# Altium schematic sheet Buffers.SchDoc
size C; SheetNumber: 4; SheetTotal: 4
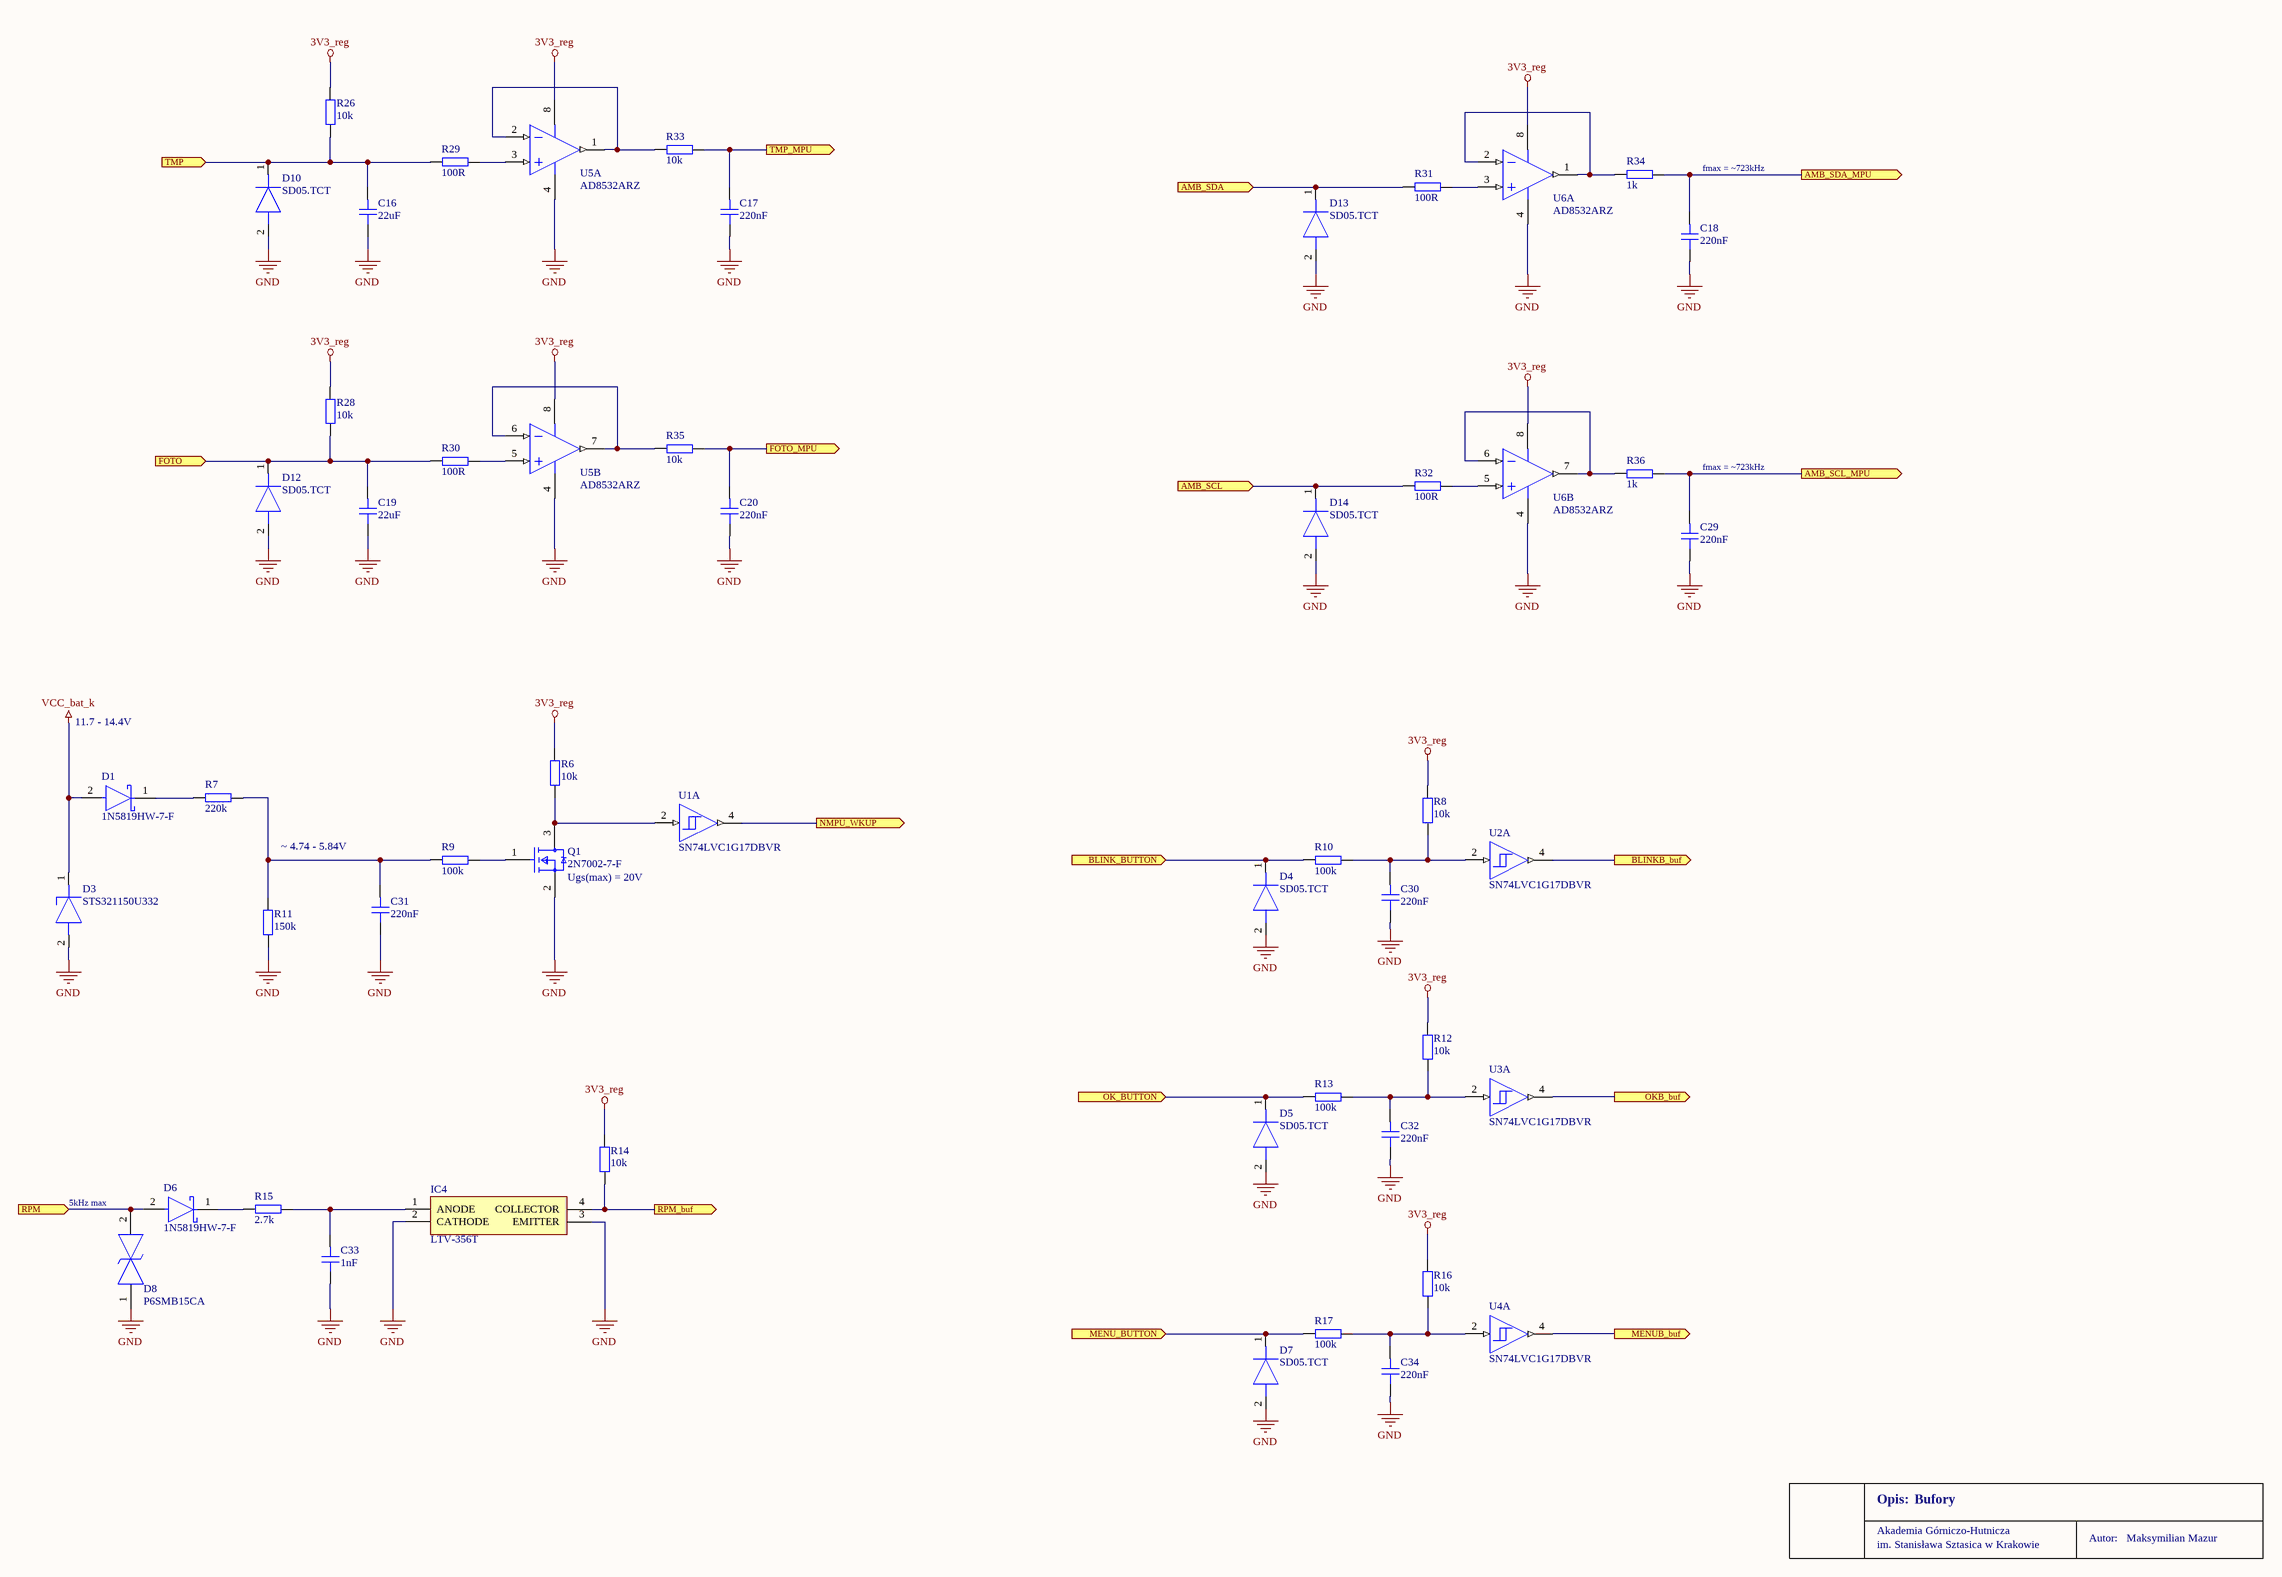
[diagram p0: Buffers.SchDoc]

## Parts
C16  22uF  [CAP_0603]
C17  220nF  [CAP_0603]
C18  220nF  [CAP_0603]
C19  22uF  [CAP_0603]
C20  220nF  [CAP_0603]
C29  220nF  [CAP_0603]
C30  220nF  [CAP_0603]
C31  220nF  [CAP_0603]
C32  220nF  [CAP_0603]
C33  1nF  [CAP_0603]
C34  220nF  [CAP_0603]
D1  1N5819HW-7-F  [FP-SOD123-IPC_A]
D3  STS321150U332  [SOD2613X100N]
D4  SD05.TCT  [SOD2513X110N]
D5  SD05.TCT  [SOD2513X110N]
D6  1N5819HW-7-F  [FP-SOD123-IPC_A]
D7  SD05.TCT  [SOD2513X110N]
D8  P6SMB15CA  [DIONM5436X261N]
D10  SD05.TCT  [SOD2513X110N]
D12  SD05.TCT  [SOD2513X110N]
D13  SD05.TCT  [SOD2513X110N]
D14  SD05.TCT  [SOD2513X110N]
IC4  LTV-356T  [SOP254P675X220-4N]
Q1  2N7002-7-F  [FP-SOT23-MFG]
R6  10k  [RES_0603]
R7  220k  [RES_0603]
R8  10k  [RES_0603]
R9  100k  [RES_0603]
R10  100k  [RES_0603]
R11  150k  [RES_0603]
R12  10k  [RES_0603]
R13  100k  [RES_0603]
R14  10k  [RES_0603]
R15  2.7k  [RES_0603]
R16  10k  [RES_0603]
R17  100k  [RES_0603]
R26  10k  [RES_0603]
R28  10k  [RES_0603]
R29  100R  [RES_0603]
R30  100R  [RES_0603]
R31  100R  [RES_0603]
R32  100R  [RES_0603]
R33  10k  [RES_0603]
R34  1k  [RES_0603]
R35  10k  [RES_0603]
R36  1k  [RES_0603]
U1  SN74LVC1G17DBVR  [DBV0005A_L]  (part A of 2)
U2  SN74LVC1G17DBVR  [DBV0005A_L]  (part A of 2)
U3  SN74LVC1G17DBVR  [DBV0005A_L]  (part A of 2)
U4  SN74LVC1G17DBVR  [DBV0005A_L]  (part A of 2)
U5  AD8532ARZ  [ADI-R-8_L]  (parts A,B of 2)
U6  AD8532ARZ  [ADI-R-8_L]  (parts A,B of 2)

## Ports
AMB_SCL (in, see Connectors[1C]), AMB_SCL_MPU (out, see MPU[7B]), AMB_SDA (in, see Connectors[1C]), AMB_SDA_MPU (out, see MPU[7B]), BLINK_BUTTON (in, see Connectors[1C]), BLINKB_buf (out, see MPU[7C]), FOTO (in, see Connectors[2C]), FOTO_MPU (out, see MPU[6D]), MENU_BUTTON (in, see Connectors[2C]), MENUB_buf (out, see MPU[7C]), NMPU_WKUP (out, see MPU[5C], PowerSupply[5C]), OK_BUTTON (in, see Connectors[2C]), OKB_buf (out, see MPU[7C]), RPM (in, see Connectors[2C]), RPM_buf (out, see MPU[5C]), TMP (in, see Connectors[2C]), TMP_MPU (out, see MPU[6D])

## Nets
3V3_reg: R6.1 R8.1 R12.1 R14.1 R16.1 R26.2 R28.2 U5.8(+V) U6.8(+V)
GND: C16.2 C17.2 C18.2 C19.2 C20.2 C29.2 C30.2 C31.2 C32.2 C33.2 C34.2 D3.2(A) D4.2(A) D5.2(A) D7.2(A) D8.1 D10.2(A) D12.2(A) D13.2(A) D14.2(A) IC4.2(CATHODE) IC4.3(EMITTER) Q1.2(S) R11.2 U5.4(-V) U6.4(-V)
VCC_bat_k: D1.2(A) D3.1(K)
AMB_SCL: D14.1(K) R32.2 ; port AMB_SCL
AMB_SCL_MPU: C29.1 R36.1 ; port AMB_SCL_MPU
AMB_SDA: D13.1(K) R31.2 ; port AMB_SDA
AMB_SDA_MPU: C18.1 R34.1 ; port AMB_SDA_MPU
BLINK_BUTTON: D4.1(K) R10.2 ; port BLINK_BUTTON
BLINKB_buf: U2.4(Y) ; port BLINKB_buf
FOTO: C19.1 D12.1(K) R28.1 R30.2 ; port FOTO
FOTO_MPU: C20.1 R35.1 ; port FOTO_MPU
MENU_BUTTON: D7.1(K) R17.2 ; port MENU_BUTTON
MENUB_buf: U4.4(Y) ; port MENUB_buf
NMPU_WKUP: U1.4(Y) ; port NMPU_WKUP
OK_BUTTON: D5.1(K) R13.2 ; port OK_BUTTON
OKB_buf: U3.4(Y) ; port OKB_buf
RPM: D6.2(A) D8.2 ; port RPM
RPM_buf: IC4.4(COLLECTOR) R14.2 ; port RPM_buf
TMP: C16.1 D10.1(K) R26.1 R29.2 ; port TMP
TMP_MPU: C17.1 R33.1 ; port TMP_MPU
NetC30_1: C30.1 R8.2 R10.1 U2.2(A)
NetC31_1: C31.1 R7.1 R9.2 R11.1
NetC32_1: C32.1 R12.2 R13.1 U3.2(A)
NetC33_1: C33.1 IC4.1(ANODE) R15.1
NetC34_1: C34.1 R16.2 R17.1 U4.2(A)
NetD1_1: D1.1(C) R7.2
NetD6_1: D6.1(C) R15.2
NetQ1_1: Q1.1(G) R9.1
NetQ1_3: Q1.3(D) R6.2 U1.2(A)
NetR29_1: R29.1 U5.3(+IN_A)
NetR30_1: R30.1 U5.5(+IN_B)
NetR31_1: R31.1 U6.3(+IN_A)
NetR32_1: R32.1 U6.5(+IN_B)
NetR33_2: R33.2 U5.1(OUT_A) U5.2(-IN_A)
NetR34_2: R34.2 U6.1(OUT_A) U6.2(-IN_A)
NetR35_2: R35.2 U5.6(-IN_B) U5.7(OUT_B)
NetR36_2: R36.2 U6.6(-IN_B) U6.7(OUT_B)

## Notes on the sheet
- fmax = ~723kHz
- 11.7 - 14.4V
- ~ 4.74 - 5.84V
- (near Q1) Ugs(max) = 20V
- (near D8) 5kHz max
- Akademia Górniczo-Hutnicza
- im. Stanisława Sztasica w Krakowie
- Opis:
- Bufory
- Autor:
- Maksymilian Mazur

## Library data of the parts
C16-C20 C29-C34 = CAP_0603: Capacitor SMD 0603 / X7R / LOW ESR; Manufacturer: *; Manufacturer Part Number: *; Distributor Link: *; LCSC: *; Rating: *; Dielectric: *
D1 D6 = CMP-0303-00003-3: DIODE SCHOTTKY 40V 1A SOD123; Forward Voltage: 450mV; Capacitance: 110pF; Max Forward Surge Current (Ifsm): 25A; Peak Reverse Current: 50uA; Polarity: Standard; Element Configuration: Single; Max Power Dissipation: 450mW; Min Operating Temperature: -65°C; Package Quantity: 3000; Contact Plating: Tin; Weight: 0.000353oz; Max Repetitive Reverse Voltage (Vrrm): 40V; Max Reverse Voltage (DC): 40V; Height: 1.25mm; Average Rectified Current: 1A; Width: 1.7mm; Case/Package: SOD-123-2; Lead Free: Lead Free; Max Operating Temperature: 125°C; Current Rating: 1A; Termination: SMD/SMT; Forward Current: 1A; Radiation Hardening: No; Number of Pins: 2; Length: 2.85mm; Voltage Rating (DC): 40V; REACH SVHC: No SVHC; Peak Non-Repetitive Surge Current: 25A; Packaging: Tape and Reel; Output Current: 1A
D3 = STS321150U751: Diode ESD (Uni-directional) / SOD-323 / 16V 330pF; Manufacturer_Name: Eaton; Datasheet Link: https://www.eaton.com/content/dam/eaton/products/electronic-components/resources/data-sheet/eaton-sts321xxxuxxx-tvs-diode-esd-suppressor-data-sheet.pdf; Height: 1mm; Manufacturer_Part_Number: STS321150U751
D4 D5 D7 D10 D12-D14 = SD05.TCT: Diode; Manufacturer_Name: SEMTECH; Datasheet Link: https://datasheet.datasheetarchive.com/originals/distributors/Datasheets-DGA26/1841681.pdf; Height: 1.1mm; Manufacturer_Part_Number: SD05.TCT; Mouser Part Number: 947-SD05.TCT; Mouser Price/Stock: https://www.mouser.co.uk/ProductDetail/Semtech/SD05.TCT?qs=rBWM4%252BvDhIed78qt1y4o0Q%3D%3D; Arrow Part Number: SD05.TCT; Arrow Price/Stock: https://www.arrow.com/en/products/sd05.tct/semtech?utm_currency=USD&region=nac
D8 = P6SMB15CA: TVS Diode (Bi-directional); Manufacturer_Name: LITTELFUSE; Datasheet Link: https://www.littelfuse.com/~/media/electronics/datasheets/tvs_diodes/littelfuse_tvs_diode_p6smb_datasheet.pdf.pdf; Height: 2.61mm; Manufacturer_Part_Number: P6SMB15CA; Mouser Part Number: 576-P6SMB15CA; Mouser Price/Stock: https://www.mouser.co.uk/ProductDetail/Littelfuse/P6SMB15CA?qs=MLCmBfHNlR44V7NRW6hWSw%3D%3D; Arrow Part Number: P6SMB15CA; Arrow Price/Stock: https://www.arrow.com/en/products/p6smb15ca/littelfuse?region=nac
IC4 = LTV-356T: Integrated Circuit; Manufacturer_Name: Lite-On; Datasheet Link: https://componentsearchengine.com/Datasheets/1/LTV-356T.pdf; Height: 2.2mm; Manufacturer_Part_Number: LTV-356T; Mouser Part Number: 859-LTV-356T; Mouser Price/Stock: https://www.mouser.co.uk/ProductDetail/LITEON/LTV-356T?qs=30I3lYpOJSWvIikXPmhOGQ%3D%3D; Arrow Part Number: LTV-356T; Arrow Price/Stock: https://www.arrow.com/en/products/ltv-356t/lite-on-technology?region=nac
Q1 = CMP-2000-04929-2: MOSFET N-CH 60V 115MA SOT23-3; Turn-On Delay Time: 7ns; Turn-Off Delay Time: 11ns; Drain to Source Resistance: 7.5R; Rise Time: 3ns; Drain to Source Breakdown Voltage: 70V; Input Capacitance: 50pF; Number of Elements: 1; Power Dissipation: 540mW; Max Power Dissipation: 300mW; Fall Time: 5.6ns; Gate to Source Voltage (Vgs): 20V; Threshold Voltage: 2.5V; Element Configuration: Single; Termination: SMD/SMT; Weight: 0.000282oz; Radiation Hardening: No; Max Operating Temperature: 150°C; On-State Resistance: 7.5R; Mount: Surface Mount; Current Rating: 115mA; Contact Plating: Tin; Lead Free: Lead Free; Min Operating Temperature: -55°C; Number of Pins: 3; REACH SVHC: No SVHC; Drain to Source Voltage (Vdss): 60V; Width: 1.3mm; Package Quantity: 3000; Length: 2.9mm; Case/Package: SOT-23; Number of Channels: 1; Dual Supply Voltage: 60V; Packaging: Tape and Reel; Height: 1mm; Voltage Rating (DC): 60V; Nominal Vgs: 2.5V; Continuous Drain Current (ID): 115mA; Voltage: 60V; Rds On Max: 7.5R
R6-R17 R26 R28-R36 = RES_0603: Resistor SMD 0603; Manufacturer: *; Manufacturer Part Number: *; Distributor Link: *; LCSC: *
U1-U4 = CMP-0859-00033-4: Single Schmitt-Trigger Buffer, DBV0005A, LARGE T&R; Manufacturer: Texas Instruments; Output Drive (IOL/IOH)(Max)(mA): 32/-32; Technology Family: LVC; ICC @ Nom Voltage(Max)(mA): 0.01; VCC(Min)(V): 1.65; F @ Nom Voltage(Max)(Mhz): 150; Schmitt Trigger: Yes; Voltage(Nom)(V): 1.8,2.5,3.3,5; 3-State Output: No; Bits(#): 1; VCC(Max)(V): 5.5; Input Type: CMOS/TTL; Logic: True; tpd @ Nom Voltage(Max)(ns): 11,6.5,5.5,5; Output Type: CMOS; Rating: Catalog; Sub-Family: Non-Inverting Buffer/Driver; PackageReference: DBV0005A; DatasheetVersion: SCES351V; Generic Part Number: SN74LVC1G17; Operating Temperature Range(C): -40 to 125,-40 to 85
U5 U6 = CMP-0384-00999-1: Double Channel Rail-to-Rail Operational Amplifier, 3 MHz BW, 5 V/us SR, Industrial, 8-pin SOIC (R-8), Tube; Generic Part Number: AD8532; Manufacturer: Analog Devices; Slew Rate: 5V/us; Iq/Amp: 1.25mA; Input Offset Voltage: 25mV; V Span Max: 6V; Input Bias Current: 5pA; V Span Min: 3V; Small Signal Bandwidth: 3MHz; Amplifiers Per Package: 2; PackageDescription: 8-Pin Standard Small Outline Package, Body 3.9 x 4.9 mm, Pitch 1.27 mm; Mounting Technology: Surface Mount; ComponentLink3Description: Package Specification; Code_JEDEC: MS-012-AA; ComponentLink1URL: http://www.analog.com/en/index.html; ComponentLink3URL: http://www.analog.com/static/imported-files/packages/PKG_PDF/SOIC_Narrow%20(R)/R_8.pdf; ComponentLink2Description: Datasheet; PackageReference: R-8; ComponentLink1Description: Manufacturer URL; DatasheetVersion: Rev. F; ComponentLink2URL: http://www.analog.com/static/imported-files/data_sheets/AD8531_8532_8534.pdf; PackageVersion: 060506-A; PartNumber: AD8532ARZ